# Altium schematic sheet Nixie_Clock.SchDoc
size A; SheetNumber: 1; SheetTotal: 3
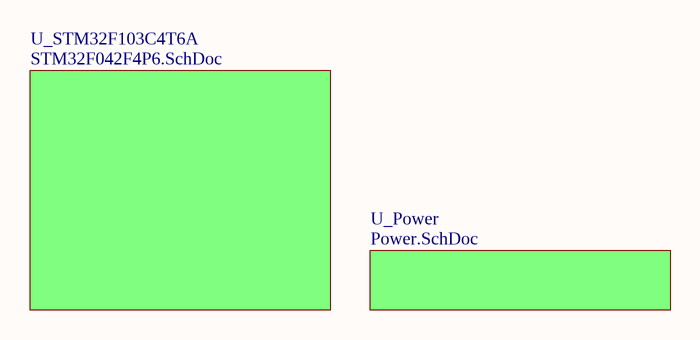
[diagram p0: Nixie_Clock.SchDoc]

## Sub-sheets
U_Power = Power.SchDoc: no entries
U_STM32F103C4T6A = STM32F042F4P6.SchDoc: no entries